# EAGLE design MUDE - Rev A (EAGLE 7.3.0)

## Sheet 1 of 2
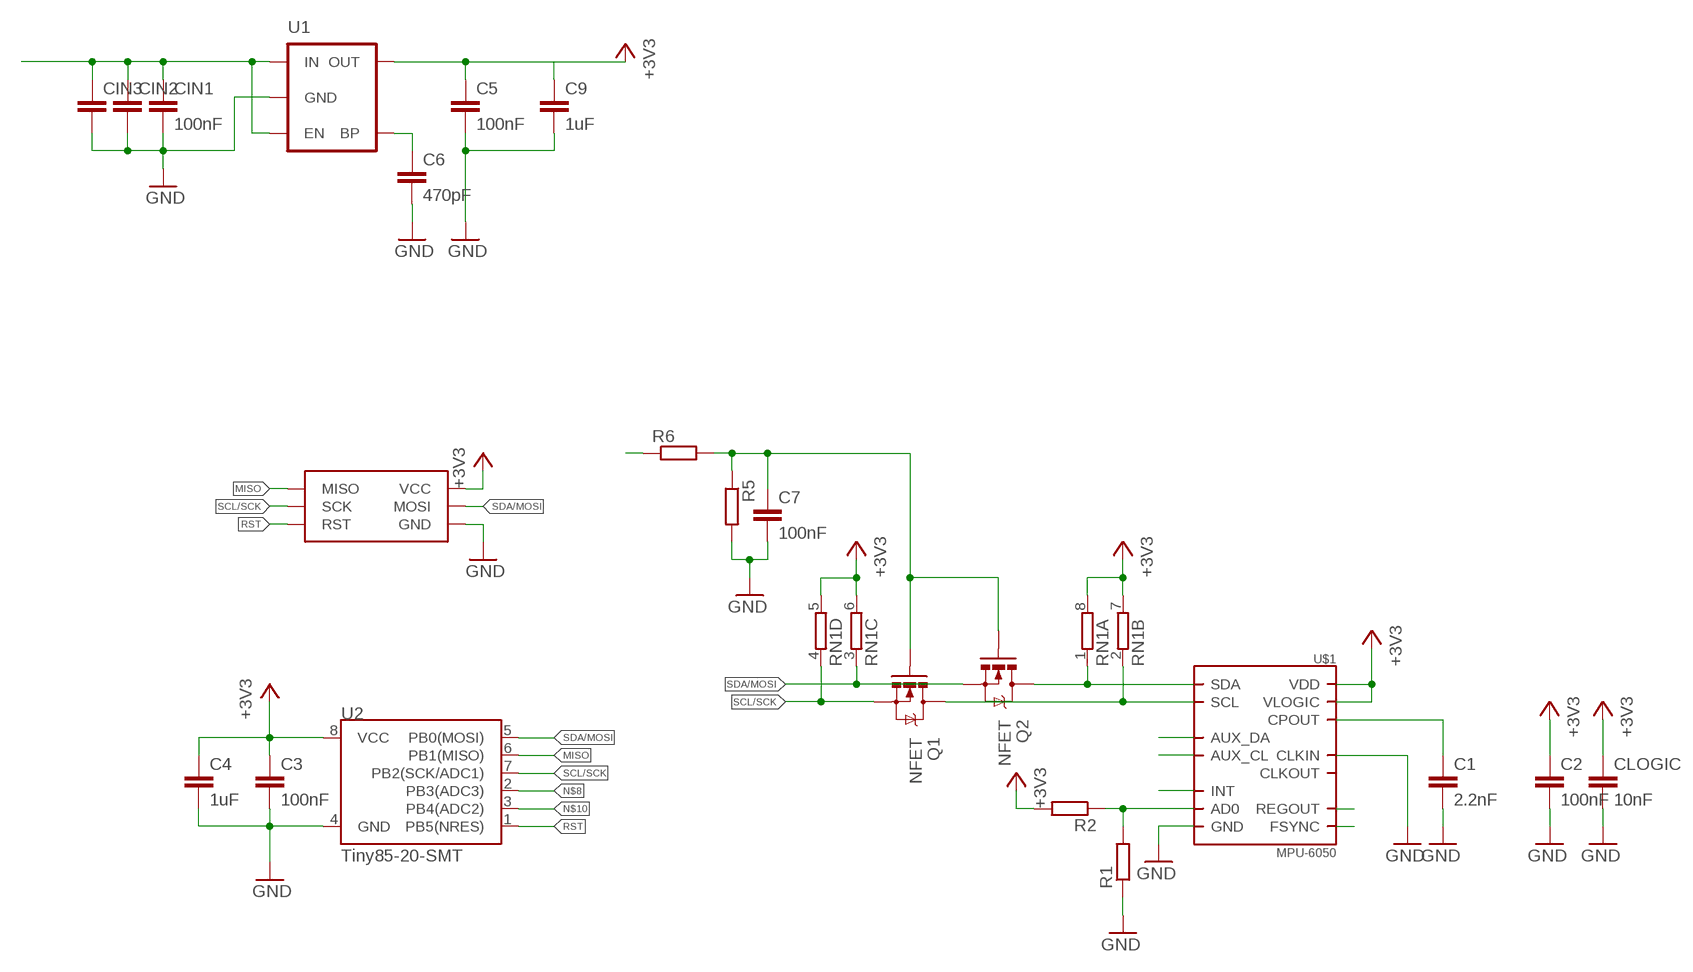
[diagram p0: schematic, sheet 1]

### Parts
C1  2.2nF  C-EUC0603  [C0603]
C2  100nF  C-EUC0603  [C0603]
C3  100nF  C-EUC0603  [C0603]
C4  1uF  C-EUC0603  [C0603]
C5  100nF  C-EUC0603  [C0603]
C6  470pF  C-EUC0603  [C0603]
C7  100nF  C-EUC0603  [C0603]
C9  1uF  C-EUC0603  [C0603]
CIN1  100nF  C-EUC0603  [C0603]
CIN2  C-EUC0805  [C0805]
CIN3  C-EUC0805  [C0805]
CLOGIC  10nF  C-EUC0603  [C0603]
Q1  NFET  MOSFET-NCHANNELBSS123LT1G  [SOT23]
Q2  NFET  MOSFET-NCHANNELBSS123LT1G  [SOT23]
R1  R-EU_R0603  [R0603]
R2  R-EU_R0603  [R0603]
R5  R-EU_R0603  [R0603]
R6  R-EU_R0603  [R0603]
RN1  4R-N0603-ARV  [0603-ARV]
U1  MIC52053.3V  [SOT23-5]
U2  Tiny85-20-SMT  ATTINY45TINY85-20-SMT  [SO08-EIAJ]
U$1  MPU-6050  [QFN.24.4X4]
U$3  ISP_POGOISP_POGO  [ISP_POGO]

### Nets
+3V3: C2.1 C3.1 C4.1 C5.1 C9.1 CLOGIC.1 R2.2 RN1.5 RN1.6 RN1.7 RN1.8 U1.5(OUT) U2.8(VCC) U$1.8(VLOGIC) U$1.13(VDD) U$3.VCC
GND: C1.2 C2.2 C3.2 C4.2 C5.2 C6.2 C7.2 C9.2 CIN1.2 CIN2.2 CIN3.2 CLOGIC.2 R1.1 R5.2 U1.2(GND) U2.4(GND) U$1.1(CLKIN) U$1.18(GND) U$3.GND
MISO: U2.6(PB1(MISO)) U$3.MISO
N$1: C1.1 U$1.20(CPOUT)
N$2: R1.2 R2.1 U$1.9(AD0)
N$3: CIN1.1 CIN2.1 CIN3.1 U1.1(IN) U1.3(EN)
N$4: U$1.6(AUX_DA)
N$5: C6.1 U1.4(BP)
N$6: U$1.7(AUX_CL)
N$7: Q2.3(D) RN1.1 U$1.24(SDA)
N$8: U2.2(PB3(ADC3))
N$9: Q1.3(D) RN1.2 U$1.23(SCL)
N$10: U2.3(PB4(ADC2))
N$11: U$1.12(INT)
N$12: U$1.10(REGOUT)
N$13: U$1.11(FSYNC)
N$14: R6.1
N$17: C7.1 Q1.1(G) Q2.1(G) R5.1 R6.2
RST: U2.1(PB5(NRES)) U$3.RST
SCL/SCK: Q1.2(S) RN1.4 U2.7(PB2(SCK/ADC1)) U$3.SCK
SDA/MOSI: Q2.2(S) RN1.3 U2.5(PB0(MOSI)) U$3.MOSI
Unconnected: U$1.22(CLKOUT)

## Sheet 2 of 2

## Library data of the parts
C1-C7 C9 CIN1-CIN3 CLOGIC = wes:C-EU: CAPACITOR, European symbol
Q1 Q2 = SparkFun-DiscreteSemi:MOSFET-NCHANNEL: Common NMOSFET Parts MFG P/N Store ID Prod ID FDD8780 TRANS-09984 SI7820DN TRANS-11055 FDS6630A IC-08089 2N7002PW TRANS-11151 FQP30N06L COM-10213 TRANS-10060 BSS123LT1G TRANS-08345 BSS138 TRANS-00830 BS170 2N7000; PROD_ID: TRANS-08345
R1 R2 R5 R6 = wes:R-EU_: RESISTOR, European symbol
RN1 = resistor-dil:4R-N: Array Chip Resistor Source: RS Component / Phycomp; OC_FARNELL: unknown; OC_NEWARK: unknown
U1 = SparkFun-PowerIC:MIC5205: MIC5205 150mA vreg 3.3V - VREG-00822 5V - VREG-00823; PROD_ID: VREG-00822
U2 = SparkFun-DigitalIC:ATTINY45: Atmel 8-pin 2/4/8kB flash uC; PROD_ID: IC-09092
U$1 = invensense:MPU-6050
U$3 = wes:ISP_POGO

## Board
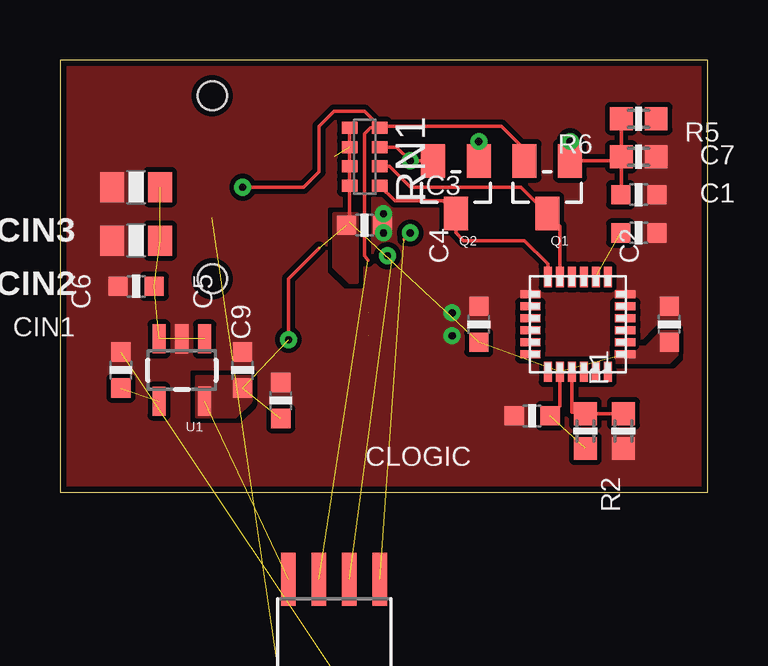
[diagram p1: board, top side]
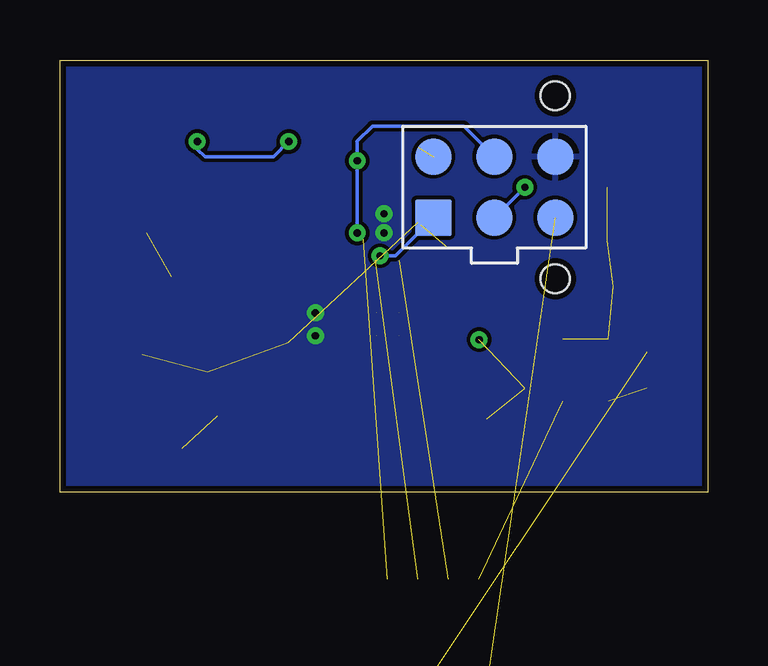
[diagram p2: board, bottom side, seen from below]

Size 27 x 18 mm. Coordinates in mm from the lower left corner, seen from the top.
Outline: 0,0 27,0 27,18 0,18 0,0
Copper layers (1*16): Top 0.035mm / dielectric 1.5mm / Bottom 0.035mm
Design rules "default *": minimum track width 6mil, minimum drill 0.3mm, track to track 6mil, track to pad 6mil, pad to pad 6mil, via to via 6mil, smd to smd 6mil, copper to edge 10mil, drill to drill 20mil, minimum pad ring 10mil, minimum via ring 8mil, stop-mask expansion 4mil, vias tented up to drill 0.3mm, thermal gap 10mil

### Footprints (pad centres in the part's own frame; a part is rotated, then mirrored left to right if it is on the bottom)
C0603 = smd 0.8 x 0.8: 1 -0.75,0; 2 0.75,0
C0805 = smd 1 x 1.25: 1 -1,0; 2 1,0
SOT23 = smd 1 x 1.4: 1 -0.95,-1.1; 2 0.95,-1.1; 3 0,1.1
R0603 = smd 0.95 x 0.95: 1 -0.725,0; 2 0.725,0
0603-ARV = smd 0.5 x 0.65: 1 -1.2,-0.625; 2 -0.4,-0.625; 3 0.4,-0.625; 4 1.2,-0.625; 5 1.2,0.625; 6 0.4,0.625; 7 -0.4,0.625; 8 -1.2,0.625
SOT23-5 = smd 0.55 x 1.2: 1 -0.95,-1.3; 2 0,-1.3; 3 0.95,-1.3; 4 0.95,1.3; 5 -0.95,1.3
SO08-EIAJ = smd 0.61 x 2.21: 1 -1.905,-3.378; 2 -0.635,-3.378; 3 0.635,-3.378; 4 1.905,-3.378; 5 1.905,3.353; 6 0.635,3.353; 7 -0.635,3.353; 8 -1.905,3.353
QFN.24.4X4 = smd 0.85 x 0.33: 1 -1.975,1.25; 2 -1.975,0.75; 3 -1.975,0.25; 4 -1.975,-0.25; 5 -1.975,-0.75; 6 -1.975,-1.25; 13 1.975,-1.25; 14 1.975,-0.75; 15 1.975,-0.25; 16 1.975,0.25; 17 1.975,0.75; 18 1.975,1.25 | smd 0.33 x 0.85: 7 -1.25,-1.975; 8 -0.75,-1.975; 9 -0.25,-1.975; 10 0.25,-1.975; 11 0.75,-1.975; 12 1.25,-1.975; 19 1.25,1.975; 20 0.75,1.975; 21 0.25,1.975; 22 -0.25,1.975; 23 -0.75,1.975; 24 -1.25,1.975
ISP_POGO = smd 1.524 x 1.524: GND 1.27,-2.54; MISO -1.27,2.54; MOSI 1.27,0; RST -1.27,-2.54; SCK -1.27,0; VCC 1.27,2.54 | hole 1.2: -3.81,-2.54; 3.81,-2.54

### Placement (x,y rotation side)
C1  24.13,10.79 0 top
C2  25.4,6.99 90 top
C3  12.7,11.11 0 top
C4  17.46,6.99 90 top
C5  7.62,5.08 90 top
C6  2.54,5.08 90 top
C7  24.13,12.38 0 top
C9  9.21,3.81 90 top
CIN1  3.17,8.57 180 top
CIN2  3.17,10.48 180 top
CIN3  3.17,12.7 180 top
CLOGIC  19.68,3.17 180 top
Q1  20.32,12.7 180 top
Q2  16.51,12.7 180 top
R1  23.5,2.54 90 top
R2  21.91,2.54 270 top
R5  24.13,13.97 0 top
R6  24.13,15.56 180 top
RN1  12.7,13.97 90 top
U1  5.08,5.08 180 top
U2  11.43,-6.99 0 top  (outside the outline)
U$1  21.59,6.99 0 top
U$3  8.89,12.7 90 bottom

### Tracks (layer width: path | path; a pad name or v marks a point on that pad's centre or on a via)
+3V3  (via drill 0.3 pad 0.5)  (9 unrouted)
  Top 0.152: RN1.5 RN1.6 RN1.7 RN1.8 12.07,11.24 C3.1 | U$1.8 20.84,3.58 CLOGIC.1 | v9.53,6.35 9.53,8.89 10.79,10.16
  pour Top (no thermals): 7.94,4.76 5.71,4.76 5.71,3.17 7.3,3.17 7.94,3.81
  pour Top (no thermals): 23.18,6.03 24.45,6.03 25.08,6.67 25.72,6.67 25.72,5.71 25.4,5.4 23.18,5.4
  pour Top (no thermals): 11.43,11.59 11.43,9.37 12.06,8.73 12.38,8.73 12.38,11.59
GND  (via drill 0.3 pad 0.5)  (5 unrouted)
  other vias: 13.49,11.59 16.35,7.46 16.35,6.51 13.49,10.79
  pour Top (isolate 0.203, rank 6, no thermals): 0,26.04 48.26,26.04 48.26,0 0,0
  pour Bottom: -1.91,22.23 -1.91,-1.91 27.3,-1.91 27.3,22.23
MISO  (via drill 0.3 pad 0.5)  (1 unrouted)
  Top 0.152: 13.84,9.66 v13.65,9.84
  Bottom 0.152: v13.65,9.84 13.02,9.84 U$3.MISO
N$1  (1 unrouted)
N$2
  Top 0.152: U$1.9 21.34,3.33 R2.1 R1.2
N$3  (4 unrouted)
N$5  (1 unrouted)
N$7
  Top 0.152: U$1.24 20.34,9.51 19.37,10.48 16.83,10.48 16.51,10.79 Q2.3 15.97,12.13 13.96,12.13 RN1.1
N$9
  Top 0.152: U$1.23 20.84,11.08 Q1.3 19.22,12.7 14.61,12.7 13.73,13.57 RN1.2
N$17  (via drill 0.3 pad 0.5)
  Top 0.152: Q2.1 v17.46,14.61 | v21.27,14.61 v21.27,14.6 Q1.1 23.23,13.8 R5.1 | R6.2 R5.1 | R5.1 23.41,12.41 C7.1
  Bottom 0.152: v17.46,14.61 18.1,13.97 20.95,13.97 21.27,14.29 v21.27,14.61
RST  (1 unrouted)
SCL/SCK  (via drill 0.3 pad 0.5)  (1 unrouted)
  Top 0.152: Q1.2 19.37,14.29 18.41,15.24 13.39,15.24 RN1.4 | 12.84,9.66 12.7,9.84 12.7,14.92 12.95,15.17 RN1.4 | v7.62,12.7 10.16,12.7 10.79,13.34 10.79,15.24 11.43,15.88 12.7,15.88 13.32,15.25 RN1.4
  Bottom 0.152: U$3.SCK v7.62,12.7
SDA/MOSI  (via drill 0.3 pad 0.5)  (1 unrouted)
  Top 0.152: 14.34,10.53 v14.61,10.79 | Q2.2 v14.61,13.8 14.04,14.37 RN1.3
  Bottom 0.152: v14.61,10.79 v14.61,13.8 14.61,14.61 13.97,15.24 10.16,15.24 U$3.MOSI